# Altium schematic sheet pay-optical.SchDoc: PAY-OPTICAL
size A4; DrawnBy: Dylan Vogel; Organization: UTAT SS; DocumentNumber: 1; Revision: 1; SheetNumber: 1; SheetTotal: 7
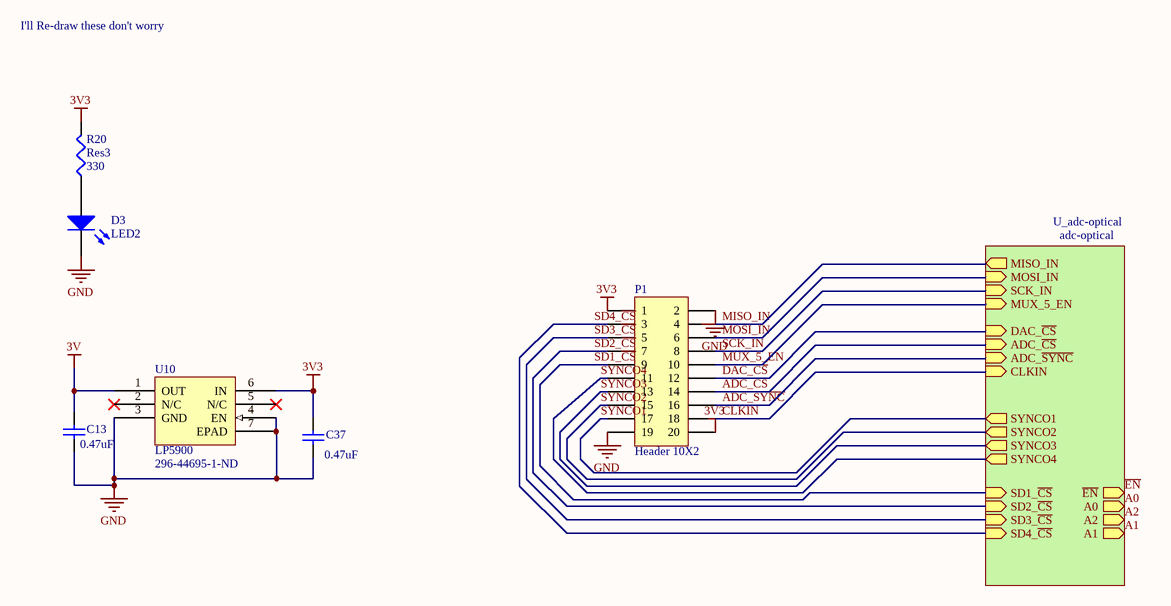
[diagram p0: pay-optical.SchDoc]

## Parts
C13  0.47uF  [1608[0603]]
C37  0.47uF  [1608[0603]]
D3  LED2  [0603-LED]
P1  Header 10X2  [CON20_2X10_DUA00]
R20  Res3  value 330  [0402]
U10  LP5900  Supplier Part Number 1: 296-44695-1-ND  [DFN220X250X80-7N]

## Sub-sheets
U_adc-optical = adc-optical: ADC_~{CS} (in), DAC_~{CS} (in), SD1_~{CS} (in), SD2_~{CS} (in), SD3_~{CS} (in), SD4_~{CS} (in), SYNCO1 (out), SYNCO2 (out), SYNCO3 (out), SYNCO4 (out), MISO_IN (out), MOSI_IN (in), SCK_IN (in), ~{EN} (out), A0 (out), A2 (out), A1 (out), ADC_~{SYNC} (in), MUX_5_EN (in), CLKIN (in)

## Nets
3V: C13.2 U10.1(OUT)
3V3: C37.2 P1.1 P1.20 R20.2 U10.6(IN)
GND: C13.1 C37.1 D3.2(K) P1.2 P1.19 U10.3(GND) U10.4(EN) U10.7(EPAD)
A0: sheet U_adc-optical/A0
A1: sheet U_adc-optical/A1
A2: sheet U_adc-optical/A2
ADC_~{CS}: P1.14 ; sheet U_adc-optical/ADC_~{CS}
ADC_~{SYNC}: P1.16 ; sheet U_adc-optical/ADC_~{SYNC}
CLKIN: P1.18 ; sheet U_adc-optical/CLKIN
DAC_~{CS}: P1.12 ; sheet U_adc-optical/DAC_~{CS}
~{EN}: sheet U_adc-optical/~{EN}
MISO_IN: P1.4 ; sheet U_adc-optical/MISO_IN
MOSI_IN: P1.6 ; sheet U_adc-optical/MOSI_IN
MUX_5_EN: P1.10 ; sheet U_adc-optical/MUX_5_EN
SCK_IN: P1.8 ; sheet U_adc-optical/SCK_IN
SD1_~{CS}: P1.9 ; sheet U_adc-optical/SD1_~{CS}
SD2_~{CS}: P1.7 ; sheet U_adc-optical/SD2_~{CS}
SD3_~{CS}: P1.5 ; sheet U_adc-optical/SD3_~{CS}
SD4_~{CS}: P1.3 ; sheet U_adc-optical/SD4_~{CS}
SYNCO1: P1.17 ; sheet U_adc-optical/SYNCO1
SYNCO2: P1.15 ; sheet U_adc-optical/SYNCO2
SYNCO3: P1.13 ; sheet U_adc-optical/SYNCO3
SYNCO4: P1.11 ; sheet U_adc-optical/SYNCO4
NetD3_1: D3.1(A) R20.1

Not connected (* = marked no-connect by the designer): U10 2(N/C)* 5(N/C)*

## Notes on the sheet
- I'll Re-draw these don't worry

## Library data of the parts
C13 C37 = Cap Semi: Capacitor (Semiconductor SIM Model); Published: 8-Jun-2000; LatestRevisionDate: 29-May-2009; LatestRevisionNote: IPC-7351 Footprint Added.; PackageReference: C1206; Publisher: Altium Limited; PackageDescription: Chip Capacitor; Value: 0.47uF; Supplier: Digi-Key
D3 = LED2: Typical RED, GREEN, YELLOW, AMBER GaAs LED; Published: 8-Jun-2000; LatestRevisionDate: 17-Jul-2002; LatestRevisionNote: Re-released for DXP Platform.; PackageVersion: Feb-2002; PackageReference: 3.2X1.6X1.1; Publisher: Altium Limited; PackageDescription: SM LED; 2 Flat Leads
P1 = Header 10X2: Header, 10-Pin, Dual row; LatestRevisionDate: 17-Jul-2002; LatestRevisionNote: Re-released for DXP Platform.; Publisher: Altium Limited
R20 = Res3: Resistor; Published: 8-Jun-2000; LatestRevisionDate: 29-May-2009; LatestRevisionNote: IPC-7351 Footprint Added.; PackageReference: J1-0603; Publisher: Altium Limited; PackageDescription: Chip Resistor
U10 = LP5900: Low noise 3V low dropout regulator for analog and RF applications.; Supplier 1: Digi-Key